# Altium schematic sheet 4_UART.SchDoc: UART
size A4; ApprovedBy: Alcatraz; CheckedBy: Alcatraz; Author: Alcatraz; CompanyName: DHNLAB; DrawnBy: Alcatraz; Engineer: Alcatraz; Organization: DHNLAB PVT LTD; Address1: DHANBAD; Address2: JHARKHAND; Address3: INDIA; Address4: ASIA; DocumentNumber: 4; Revision: 1.0; SheetNumber: 4; SheetTotal: 10; ProjectTitle: ESP8266-Deskop_Power
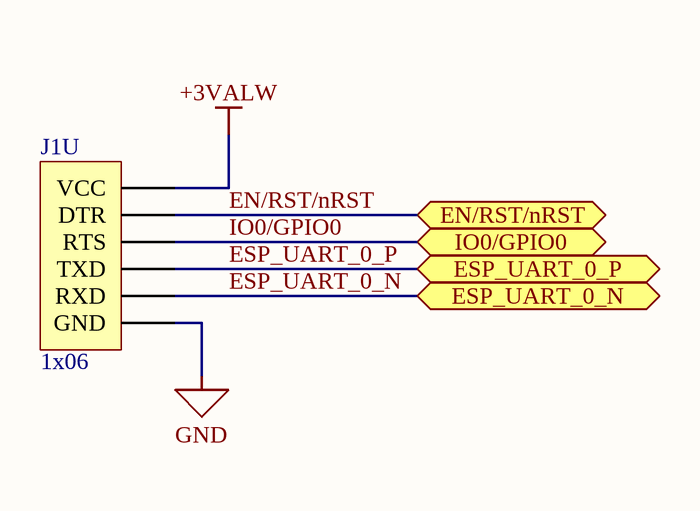
[diagram p0: 4_UART.SchDoc]

## Parts
J1U  1x06  [PinHeader_1x06_P2.54mm_Vertical_No_3D]

## Ports
EN/RST/nRST (bidir), ESP_UART_0_N (bidir, see 4_ESP32-Core[3B]), ESP_UART_0_P (bidir, see 4_ESP32-Core[3B]), IO0/GPIO0 (bidir)

## Nets
+3VALW: J1U.6(VCC)
GND: J1U.1(GND)
EN/RST/nRST: J1U.5(DTR) ; port EN/RST/nRST
ESP_UART_0_N: J1U.2(RXD) ; port ESP_UART_0_N
ESP_UART_0_P: J1U.3(TXD) ; port ESP_UART_0_P
IO0/GPIO0: J1U.4(RTS) ; port IO0/GPIO0

## Notes on the sheet
- Title:
- Author:
- Approved:
- Size:
- Date:
- Git Hash:
- A4
- Prj:
- SW Version:
- Variant:
- Edited:
- PUBLIC
- File:

## Library data of the parts
J1U = UART_1X06_P2.54mm_2